# Altium schematic sheet SheetMain.SchDoc
size B
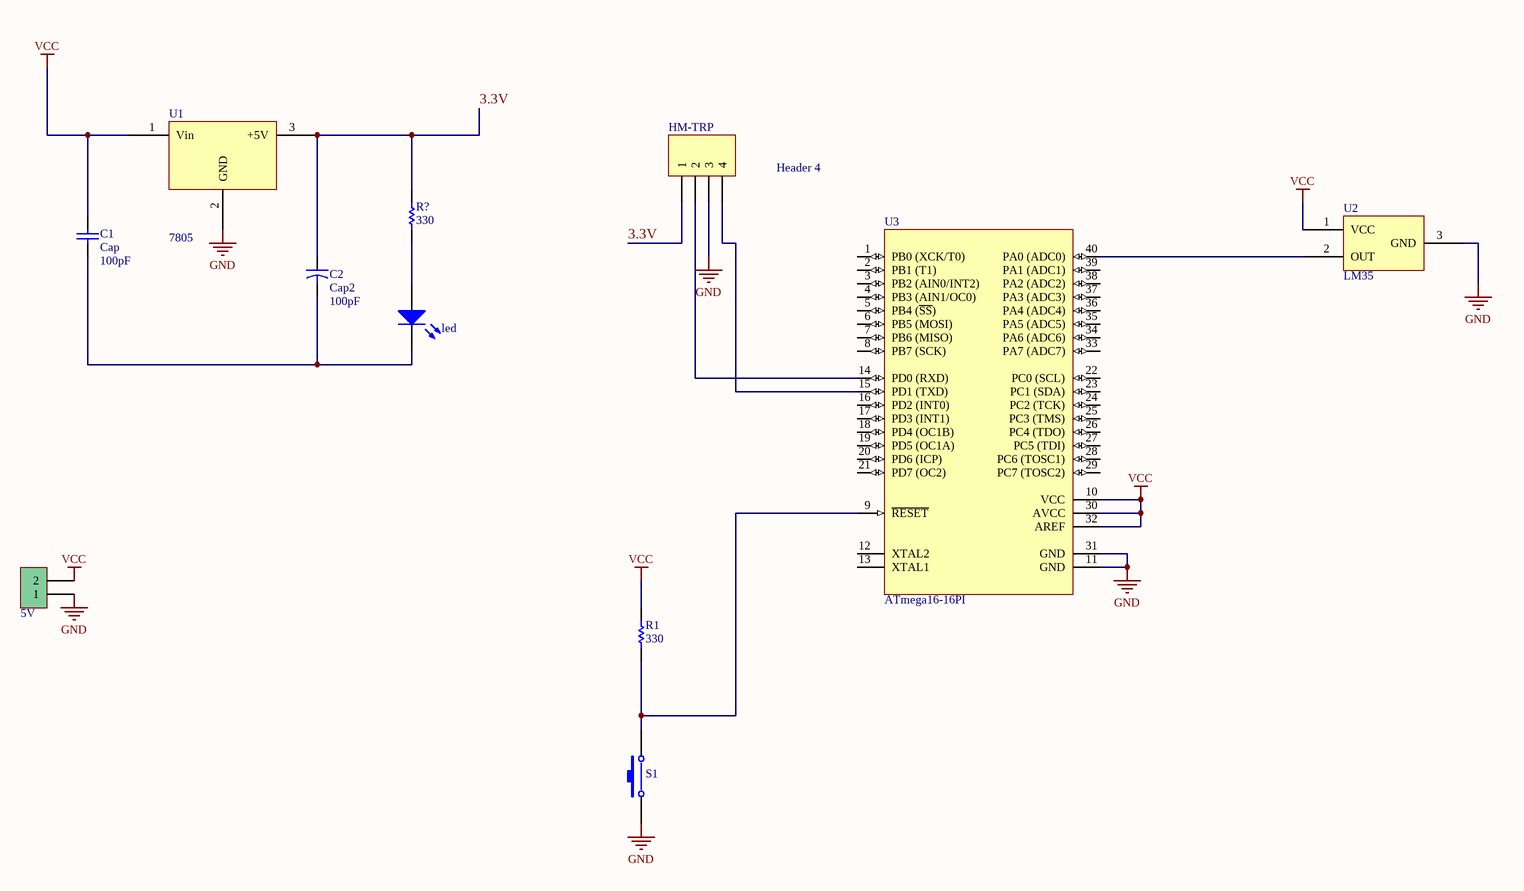
[diagram p0: SheetMain.SchDoc]

## Parts
5V  Phoenix terminal  [phoenix terminal 2]  (value not drawn)
C1  Cap  value 100pF  [RAD-0.1]
C2  Cap2  value 100pF  [CAPR5-4X5]
HM-TRP  Header 4  [HDR1X4]
led  LED 3mm  [LED-3mm]  (value not drawn)
R1  value 330  [Res50]  (hidden comment: Resistor vertical)
R?  value 330  [Res50]  (hidden comment: Resistor vertical)
S1  PB-2pin  [PB-2pin]  (value not drawn)
U1  7805  [My_TO-220]
U2  LM35  [LM35-TO92]
U3  ATmega16-16PI  [My_40P6]

## Nets
GND: 5V.1 HM-TRP.3 S1.1 U1.2(GND) U2.3(GND) U3.11(GND) U3.31(GND)
VCC: 5V.2 C1.2 R1.2 U1.1(Vin) U2.1(VCC) U3.10(VCC) U3.30(AVCC) U3.32(AREF)
3.3V: C2.1 HM-TRP.1 R?.2 U1.3(+5V)
NetC1_1: C1.1 C2.2 led.2(K)
NetHM-TRP_2: HM-TRP.2 U3.14(PD0_(RXD))
NetHM-TRP_4: HM-TRP.4 U3.15(PD1_(TXD))
Netled_1: led.1(A) R?.1
NetR1_1: R1.1 S1.2 U3.9(~{RESET})
NetU2_2: U2.2(OUT) U3.40(PA0_(ADC0))

Not connected (* = marked no-connect by the designer): U3 1(PB0_(XCK/T0)) 2(PB1_(T1)) 3(PB2_(AIN0/INT2)) 4(PB3_(AIN1/OC0)) 5(PB4_(~{SS})) 6(PB5_(MOSI)) 7(PB6_(MISO)) 8(PB7_(SCK)) 12(XTAL2) 13(XTAL1) 16(PD2_(INT0)) 17(PD3_(INT1)) 18(PD4_(OC1B)) 19(PD5_(OC1A)) 20(PD6_(ICP)) 21(PD7_(OC2)) 22(PC0_(SCL)) 23(PC1_(SDA)) 24(PC2_(TCK)) 25(PC3_(TMS)) 26(PC4_(TDO)) 27(PC5_(TDI)) 28(PC6_(TOSC1)) 29(PC7_(TOSC2)) 33(PA7_(ADC7)) 34(PA6_(ADC6)) 35(PA5_(ADC5)) 36(PA4_(ADC4)) 37(PA3_(ADC3)) 38(PA2_(ADC2)) 39(PA1_(ADC1))

## Library data of the parts
5V = Phoenix terminal 2: Terminal 2 Pin; Designer: Seyed Mohsen Ghasemain; E-mail: picpars@gmail.com; ComponentLinkURL: www.picpars.com
C1 = Cap: Capacitor; Published: 8-Jun-2000; LatestRevisionDate: 17-Jul-2002; LatestRevisionNote: Re-released for DXP Platform.; PackageReference: RAD-0.3; Publisher: Altium Limited; PackageDescription: Radial Cap, Thru-Hole; 2 Leads; 0.3 in Pin Spacing
C2 = Cap2: Capacitor; Published: 23-Sep-2002; PackageReference: CAPR5-4X5; Publisher: Altium Limited; PackageDescription: Capacitor; 2 Leads
HM-TRP = Header 4: Header, 4-Pin; LatestRevisionDate: 17-Jul-2002; LatestRevisionNote: Re-released for DXP Platform.; Publisher: Altium Limited
led = LED 3mm: Typical LED; Designer: Seyed Mohsen Ghasemian; Published: 02/04/2012; PackageReference: LED; Publisher: www.picpars.com; PackageDescription: LED; 2 Leads
R1 R? = Resistor vertical: Resistor 0.5; Publisher: Seyed mohsen ghasemian; WEB: www.picpars.com
S1 = PB-2pin: Switch; E-mail: picpars@gmail.com; Designer: Seyed Mohsen Ghasemian; Publisher: www.picpars.com; WEB: www.picpars.com
U1 = 7805: Regulator
U2 = LM35: LM35 Temperature Sensor; Designer: Seyed Mohsen Ghasemain; E-mail: picpars@gmail.com; ComponentLinkURL: www.picpars.com
U3 = ATmega16-16PI: AVR 16K Bytes of In-System Programmable Flash Memory; Published: 17-Sep-2003; LatestRevisionDate: 04-Mar-2005; LatestRevisionNote: Stylized 3D Model Added.; DatasheetVersion: 2466E-AVR-10/02; PackageVersion: Dec-1999; PackageReference: 40P6; Publisher: Altium Limited; PackageDescription: DIP; 40 Leads; Row Spacing 15.24 mm; Pitch 2.54 mm; ComponentLink1Description: Manufacturer Link; ComponentLink1URL: http://www.atmel.com; ComponentLink2Description: Datasheet; ComponentLink2URL: http://www.atmel.com/dyn/resources/prod_documents/doc2466.pdf